# Altium schematic sheet APP_1_Stepper.SchDoc
size Tabloid; SheetNumber: 8; SheetTotal: 10; Sheet_Name: Insert name in Document Parameters; Size: 11x17
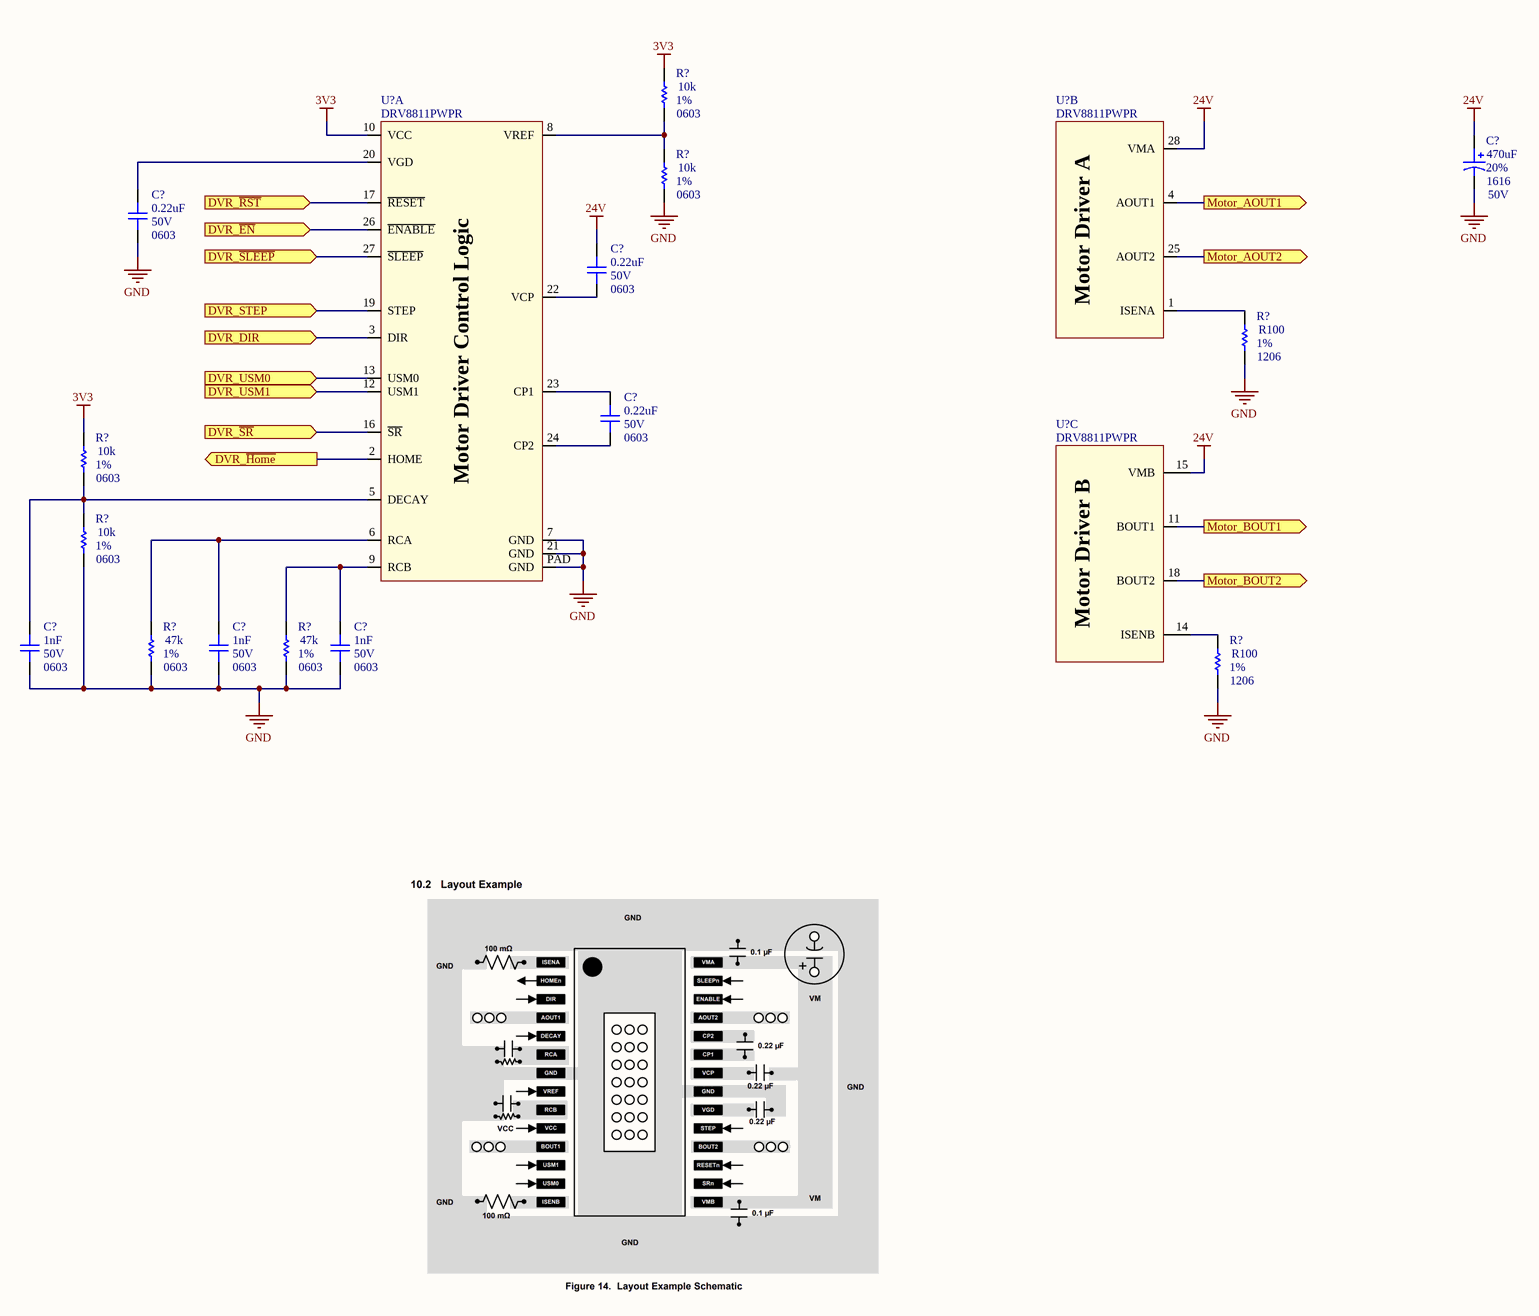
[diagram p0: APP_1_Stepper.SchDoc]

## Parts
(Parts that share a designator on the sheet are numbered #1, #2 ... from top to bottom, then left to right.)
C?#1  value 470uF  Voltage: 50V  Package: 1616  Precision: 20%  [CAP_ALU_1616_vishay]  (hidden comment: MAL214699108E3)
C?#2  value 0.22uF  Voltage: 50V  Package: 0603  [CAP_0603]  (hidden comment: CAP - 0603)
C?#3  value 0.22uF  Voltage: 50V  Package: 0603  [CAP_0603]  (hidden comment: CAP - 0603)
C?#4  value 0.22uF  Voltage: 50V  Package: 0603  [CAP_0603]  (hidden comment: CAP - 0603)
C?#5  value 1nF  Voltage: 50V  Package: 0603  [CAP_0603]  (hidden comment: CAP - 0603)
C?#6  value 1nF  Voltage: 50V  Package: 0603  [CAP_0603]  (hidden comment: CAP - 0603)
C?#7  value 1nF  Voltage: 50V  Package: 0603  [CAP_0603]  (hidden comment: CAP - 0603)
R?#1  value 10k  Package: 0603  Precision: 1%  [RES_0603]  (hidden comment: RES - 0603)
R?#2  value 10k  Package: 0603  Precision: 1%  [RES_0603]  (hidden comment: RES - 0603)
R?#3  value R100  Package: 1206  Precision: 1%  [RES_1206]  (hidden comment: RES - 1206)
R?#4  value 10k  Package: 0603  Precision: 1%  [RES_0603]  (hidden comment: RES - 0603)
R?#5  value 10k  Package: 0603  Precision: 1%  [RES_0603]  (hidden comment: RES - 0603)
R?#6  value 47k  Package: 0603  Precision: 1%  [RES_0603]  (hidden comment: RES - 0603)
R?#7  value 47k  Package: 0603  Precision: 1%  [RES_0603]  (hidden comment: RES - 0603)
R?#8  value R100  Package: 1206  Precision: 1%  [RES_1206]  (hidden comment: RES - 1206)
U?#1  DRV8811PWPR  [POW_MOTOR_DRV8811PWPR]  (part A of 3)
U?#2  DRV8811PWPR  [POW_MOTOR_DRV8811PWPR]  (part B of 3)
U?#3  DRV8811PWPR  [POW_MOTOR_DRV8811PWPR]  (part C of 3)

## Ports
DVR_DIR (in), DVR_STEP (in), DVR_USM0 (in), DVR_USM1 (in), DVR_~{EN} (in), DVR_~{Home} (out), DVR_~{RST} (in), DVR_~{SLEEP} (in), DVR_~{SR} (in), Motor_AOUT1 (out), Motor_AOUT2 (out), Motor_BOUT1 (out), Motor_BOUT2 (out)

## Nets
3V3: R?#1.2 R?#4.2 U?#1.10(VCC)
24V: C?#1.1 C?#3.2 U?#2.28(VMA) U?#3.15(VMB)
GND: C?#1.2 C?#2.1 C?#5.1 C?#6.1 C?#7.1 R?#2.1 R?#3.1 R?#5.1 R?#6.1 R?#7.1 R?#8.1 U?#1.7(GND) U?#1.21(GND) U?#1.PAD(GND)
DVR_DIR: U?#1.3(DIR) ; port DVR_DIR
DVR_~{EN}: U?#1.26(~{ENABLE}) ; port DVR_~{EN}
DVR_~{Home}: U?#1.2(HOME) ; port DVR_~{Home}
DVR_~{RST}: U?#1.17(~{RESET}) ; port DVR_~{RST}
DVR_~{SLEEP}: U?#1.27(~{SLEEP}) ; port DVR_~{SLEEP}
DVR_~{SR}: U?#1.16(~{SR}) ; port DVR_~{SR}
DVR_STEP: U?#1.19(STEP) ; port DVR_STEP
DVR_USM0: U?#1.13(USM0) ; port DVR_USM0
DVR_USM1: U?#1.12(USM1) ; port DVR_USM1
Motor_AOUT1: U?#2.4(AOUT1) ; port Motor_AOUT1
Motor_AOUT2: U?#2.25(AOUT2) ; port Motor_AOUT2
Motor_BOUT1: U?#3.11(BOUT1) ; port Motor_BOUT1
Motor_BOUT2: U?#3.18(BOUT2) ; port Motor_BOUT2
NetC?#2_2: C?#2.2 U?#1.20(VGD)
NetC?#3_1: C?#3.1 U?#1.22(VCP)
NetC?#4_1: C?#4.1 U?#1.24(CP2)
NetC?#4_2: C?#4.2 U?#1.23(CP1)
NetC?#5_2: C?#5.2 R?#4.1 R?#5.2 U?#1.5(DECAY)
NetC?#6_2: C?#6.2 R?#6.2 U?#1.6(RCA)
NetC?#7_2: C?#7.2 R?#7.2 U?#1.9(RCB)
NetR?#1_1: R?#1.1 R?#2.2 U?#1.8(VREF)
NetR?#3_2: R?#3.2 U?#2.1(ISENA)
NetR?#8_2: R?#8.2 U?#3.14(ISENB)

## Notes on the sheet
- Sheet Name
- Project Title
- Global Project
- Size
- Group
- Revision
- Date
- Sheet
- of
- Filename
- Designers
- (in symbol POW_MOTOR_DRV8811PWPR, part A) Motor Driver Control Logic
- (in symbol POW_MOTOR_DRV8811PWPR, part B) Motor Driver A
- (in symbol POW_MOTOR_DRV8811PWPR, part C) Motor Driver B

## Library data of the parts
C?#1 = CAP_ALU_MAL214699108E3: CAP - ALU 470uF 20% 50V - 1616; Current: 1.3A; Mfg: Vishay Dale; Mfg Part Number: MAL214699108E3; HelpURL: http://www.vishay.com/docs/28403/146cti.pdf; CreatedBy: Jonathan Bouchard; Temperature: -55°C to 125°C; Power: *; Supplier 1: Digikey; Supplier Part Number 1: 4442PHCT-ND
C?#2-C?#7 = CAP - 0603: Precision: 10%; Current: *; CreatedBy: Jonathan Bouchard; Power: *
U?#1-U?#3 = POW_MOTOR_DRV8811PWPR: POW - STEPPER MOTOR DRIVER - SOP-28; Voltage: 3 V ~ 5.5 V / 8 V ~ 38 V; Mfg: Texas Instrument; Current: *; Power: *; Mfg Part Number: DRV8811PWPR; HelpURL: http://www.ti.com/lit/ds/symlink/drv8811.pdf; CreatedBy: Jonathan Bouchard; Temperature: -40°C ~ 150°C (TJ); Value: *; Precision: *; Package: SOP-28; Supplier 1: Digikey; Supplier Part Number 1: 296-24591-1-ND
R?#1 R?#2 R?#4-R?#7 = RES - 0603: Current: *; CreatedBy: Jonathan Bouchard
R?#3 R?#8 = RES - 1206: Current: *; CreatedBy: Jonathan Bouchard